# EAGLE design pcb v3 (EAGLE 7.5.0)
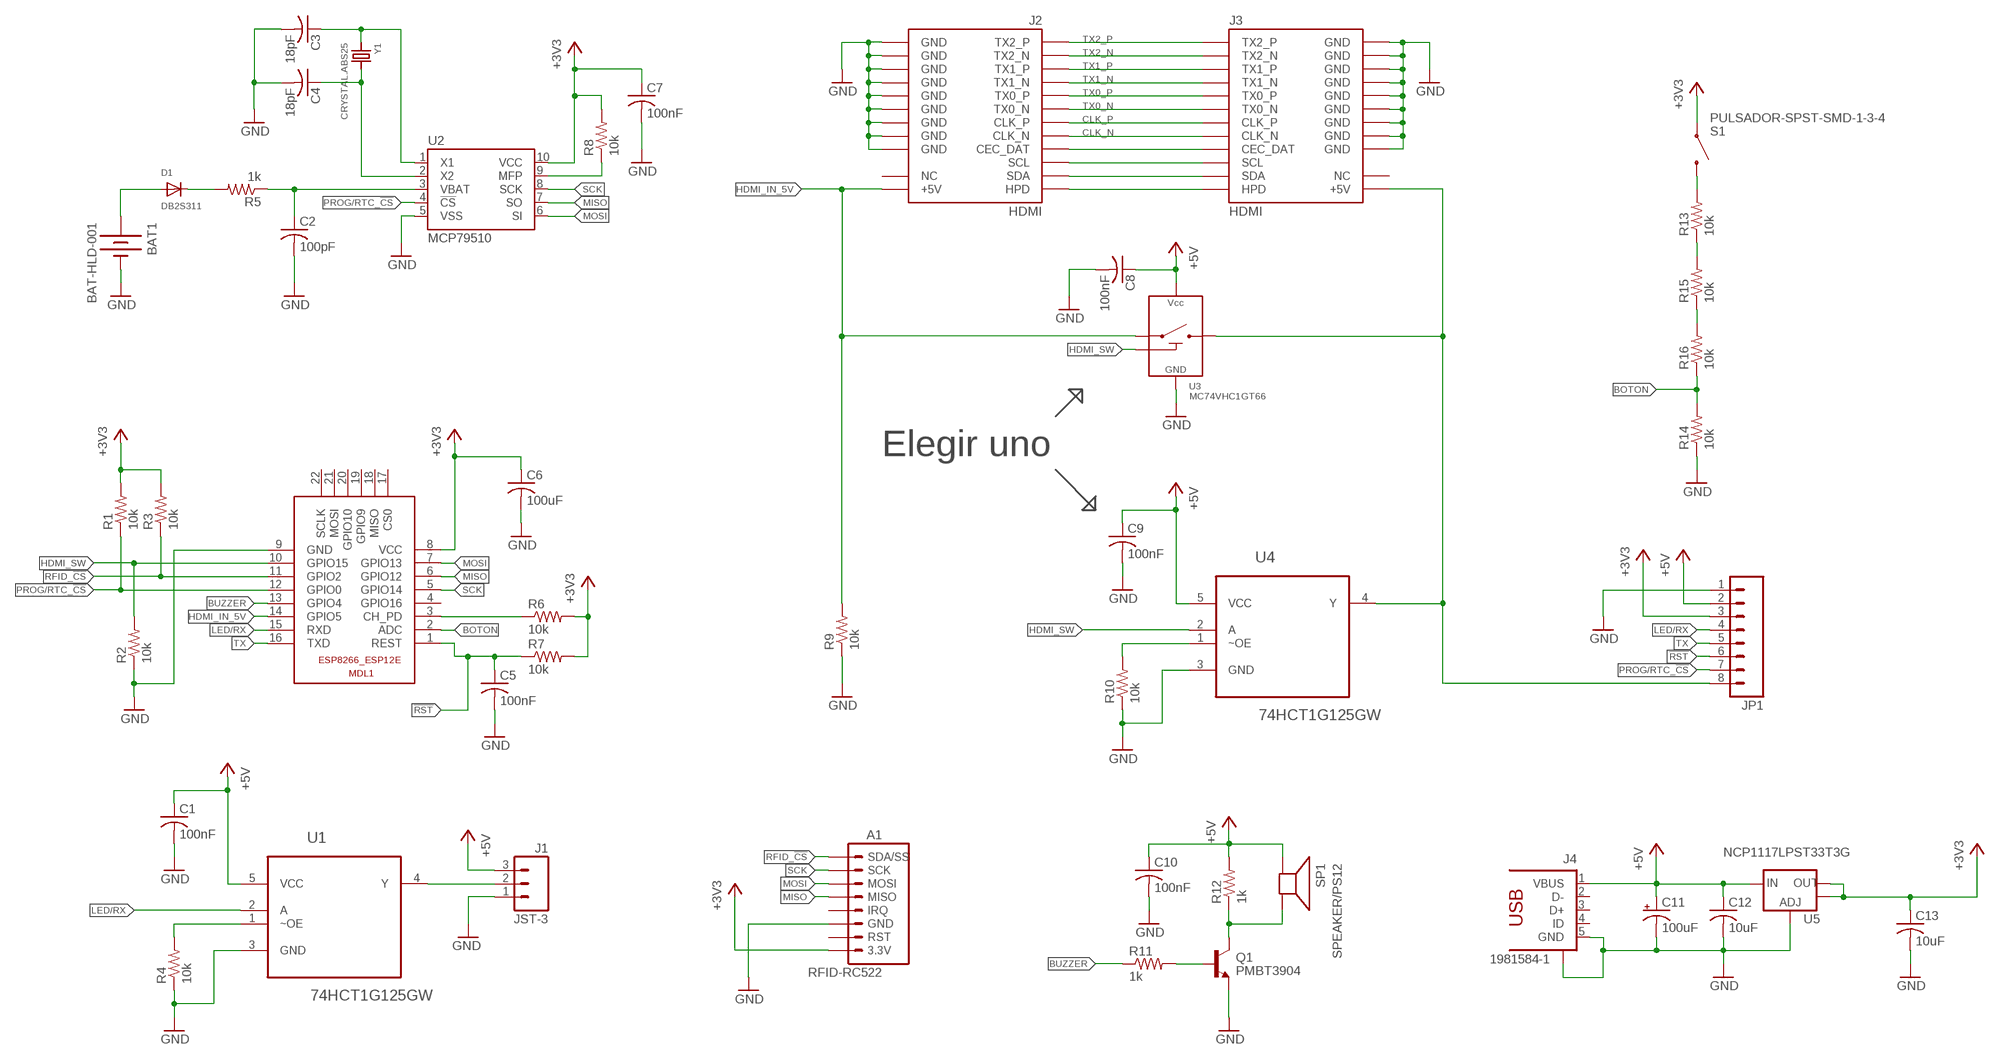
[diagram p0: schematic, sheet 1]

## Parts
A1  RFID-RC522  [RFID-RC522]
BAT1  BAT-HLD-001  LINX-BAT-HLD-00120SMD  [BATTCON_20MM]
C1  100nF  C-USC0805  [C0805]
C2  100pF  C-USC0805  [C0805]
C3  18pF  C-USC0805  [C0805]
C4  18pF  C-USC0805  [C0805]
C5  100nF  C-USC0805  [C0805]
C6  100uF  C-USC1206  [C1206]
C7  100nF  C-USC0805  [C0805]
C8  100nF  C-USC0805  [C0805]
C9  100nF  C-USC0805  [C0805]
C10  100nF  C-USC0805  [C0805]
C11  100uF  CPOL-US  [UD-6,3X5,8_NICHICON_LPADS]
C12  10uF  C-USC0805  [C0805]
C13  10uF  C-USC0805  [C0805]
D1  DB2S311  DIODESOD-523  [SOD-523]
J1  JST-3  [B3B-PH-SM4-TB]
J2  HDMI  [0471511071]
J3  HDMI  [0471511071]
J4  1981584-1  [1981584-1]
JP1  M081X08  [1X08]
MDL1  ESP8266-12EESP8266-ESP12E  [ESP8266-ESP12E]
Q1  PMBT3904  [SOT-23-3]
R1  10k  R-US_R0805  [R0805]
R2  10k  R-US_R0805  [R0805]
R3  10k  R-US_R0805  [R0805]
R4  10k  R-US_R0805  [R0805]
R5  1k  R-US_R0805  [R0805]
R6  10k  R-US_R0805  [R0805]
R7  10k  R-US_R0805  [R0805]
R8  10k  R-US_R0805  [R0805]
R9  10k  R-US_R0805  [R0805]
R10  10k  R-US_R0805  [R0805]
R11  1k  R-US_R0805  [R0805]
R12  1k  R-US_R0805  [R0805]
R13  10k  R-US_R0805  [R0805]
R14  10k  R-US_R0805  [R0805]
R15  10k  R-US_R0805  [R0805]
R16  10k  R-US_R0805  [R0805]
S1  PULSADOR-SPST-SMD-1-3-4  [PTS645SM43SMTR92]
SP1  SPEAKER/PS12  [PS12]
U1  74HCT1G125GW  [SOT65P210X110-5N]
U2  MCP79510  [MSOP10]
U3  MC74VHC1GT66  [TSOP-5]
U4  74HCT1G125GW  [SOT65P210X110-5N]
U5  NCP1117LPST33T3G  V_REG_LM1117SOT223  [SOT223]
Y1  CRYSTAL.ABS25  [ABS25]

## Nets
!RST: C5.1 JP1.6 MDL1.1(REST) R7.1
+3V3: A1.3.3V C6.1 C7.1 C13.1 JP1.3 MDL1.8(VCC) R1.2 R3.2 R6.2 R7.2 R8.2 S1.P$1 U2.10(VCC) U5.2(OUT) U5.4(OUT)
+5V: C1.1 C8.1 C9.1 C10.1 C11.+ C12.1 J1.3 J4.1(VBUS) JP1.2 R12.2 SP1.P$1(+) U1.5(VCC) U3.5 U4.5(VCC) U5.3(IN)
BOTON: MDL1.2(ADC) R14.2 R16.1
BUZZER: MDL1.13(GPIO4) R11.1
CLK_N [hdmi]: J2.P$12(CLK_N) J3.P$12(CLK_N)
CLK_P [hdmi]: J2.P$10(CLK_P) J3.P$10(CLK_P)
GND [gnd]: A1.GND BAT1.2(-) C1.2 C2.2 C3.2 C4.2 C5.2 C6.2 C7.2 C8.2 C9.2 C10.2 C11.- C12.2 C13.2 J1.1 J2.P$2(GND) J2.P$5(GND) J2.P$8(GND) J2.P$11(GND) J2.P$17(GND) J2.P$20(GND) J2.P$21(GND) J2.P$22(GND) J2.P$23(GND) J3.P$2(GND) J3.P$5(GND) J3.P$8(GND) J3.P$11(GND) J3.P$17(GND) J3.P$20(GND) J3.P$21(GND) J3.P$22(GND) J3.P$23(GND) J4.5(GND) J4.S1 J4.S2 J4.S3 J4.S4 JP1.1 MDL1.9(GND) Q1.2(E) R2.1 R4.1 R9.1 R10.1 R14.1 U1.3(GND) U2.5(VSS) U3.3 U4.3(GND) U5.1(ADJ)
HDMI_IN_5V: J2.P$18(+5V) MDL1.14(GPIO5) R9.2 U3.1
HDMI_OUT_5V: J3.P$18(+5V) JP1.8 U3.2 U4.4(Y)
HDMI_SW: MDL1.10(GPIO15) R2.2 U3.4 U4.2(A)
LED/RX: JP1.4 MDL1.15(RXD) U1.2(A)
MISO: A1.MISO MDL1.6(GPIO12) U2.7(SO)
MOSI: A1.MOSI MDL1.7(GPIO13) U2.6(SI)
N$1: Q1.1(B) R11.2
N$2: C3.1 U2.1(X1) Y1.1
N$3: C4.1 U2.2(X2) Y1.4
N$4: R4.2 U1.1(~OE)
N$5: Q1.3(C) R12.1 SP1.P$2(-)
N$6: R8.1 U2.9(MFP)
N$7: BAT1.1(+) D1.A
N$8: D1.K(C) R5.2
N$9: C2.1 R5.1 U2.3(VBAT)
N$10: MDL1.3(CH_PD) R6.1
N$11: J1.2 U1.4(Y)
N$12: R13.2 S1.P$3 S1.P$4
N$13: R13.1 R15.2
N$14: R15.1 R16.2
N$15: R10.2 U4.1(~OE)
N$30: J2.P$13(CEC_DAT) J3.P$13(CEC_DAT)
N$31: J2.P$15(SCL) J3.P$15(SCL)
N$32: J2.P$16(SDA) J3.P$16(SDA)
N$33: J2.P$19(HPD) J3.P$19(HPD)
PROG/RTC_!CS: JP1.7 MDL1.12(GPIO0) R1.1 U2.4(!CS)
RFID_!CS: A1.SDA(SDA/SS) MDL1.11(GPIO2) R3.1
SCK: A1.SCK MDL1.5(GPIO14) U2.8(SCK)
TX: JP1.5 MDL1.16(TXD)
TX0_N [hdmi]: J2.P$9(TX0_N) J3.P$9(TX0_N)
TX0_P [hdmi]: J2.P$7(TX0_P) J3.P$7(TX0_P)
TX1_N [hdmi]: J2.P$6(TX1_N) J3.P$6(TX1_N)
TX1_P [hdmi]: J2.P$4(TX1_P) J3.P$4(TX1_P)
TX2_N [hdmi]: J2.P$3(TX2_N) J3.P$3(TX2_N)
TX2_P [hdmi]: J2.P$1(TX2_P) J3.P$1(TX2_P)
Unconnected: A1.IRQ A1.RST J2.P$14(NC) J3.P$14(NC) J4.2(D-) J4.3(D+) J4.4(ID) MDL1.4(GPIO16) MDL1.17(CS0) MDL1.18(MISO) MDL1.19(GPIO9) MDL1.20(GPIO10) MDL1.21(MOSI) MDL1.22(SCLK)

## Notes on the sheet
- Elegir uno

## Library data of the parts
A1 = partes v2:RFID-RC522
BAT1 = battery:LINX-BAT-HLD-001: Battery Holders Linxtechnologies CR2032 battery holder: http://www.linxtechnologies.com/resources/diagrams/bat-hld-001.pdf
C1-C10 C12 C13 = rcl:C-US: CAPACITOR, American symbol
C11 = hoky:CPOL-US
D1 = adafruit:DIODE: Diode SMADIODE - SMA Surface Mount Package 20V 1A Schottky Diode Digikey: 641-1014-6-ND DO-1N4148 - Through Hole Small Current Diode SOD-123 20V 1 A (.5mV Vf) Schottky Diode - Digikey: MBRX120TPMSCT-ND SOD-323 10V 570mA (.38mV Vf, 3ns) Schottky Diode - Digikey: ZLLS410CT-ND SOD-523 30V 30mA Schottky Diode (RB751S-40TE61) - Digikey: RB751S-40TE61CT-ND SOT23-R/W - SOT23 Package (R = Solder Paste/Reflow Ovens, W = Hand-Soldering) BAT54Film 40V 300mA - Digikey: 497-7162-1-ND
J1 = partes v2:JST-3
J2 J3 = partes v2:HDMI
J4 = con-usb:1981584-1: Receptacle, micro-USB, type A/B Tyco Electronics
JP1 = SparkFun-Connectors:M08: Header 8 Standard 8-pin 0.1" header. Use with straight break away headers (SKU : PRT-00116), right angle break away headers (PRT-00553), swiss pins (PRT-00743), machine pins (PRT-00117), and female headers (PRT-00115).
MDL1 = ESP8266-ESP12E:ESP8266-12E: ESP8266-12E with additional I/O and GPIO04/05 corrected The author cannot warrant that this library is free from error or will meet your specific requirements. Created by PuceBaboon.com. Komagane, Nagano, JAPAN
Q1 = diego:PMBT3904: PMBT3904 NPN switching transistor in a SOT23 plastic package. PNP complement: PMBT3906.
R1-R16 = rcl:R-US_: RESISTOR, American symbol
S1 = partes v2:PULSADOR-SPST
SP1 = adafruit:SPEAKER: SPEAKER Source: Buerklin Added PS12 (for part # PS1240 piezo) http://www.ladyada.net/library/pcb/eaglelibrary.html
U1 U4 = NXP_By_element14_Batch_1:74HCT1G125GW: Bus buffer/line driver; MPN: 74HCT1G125GW; OC_FARNELL: 1085267; OC_NEWARK: 99K0542; PACKAGE: SOT-5; SUPPLIER: NXP
U2 = hoky:MCP79510
U3 = hoky:MC74VHC1GT66
U5 = SparkFun-PowerIC:V_REG_LM1117: Voltage Regulator LM1117 Standard adjustable voltage regulator but in SMD form. Spark Fun Electronics SKU : COM-00595
Y1 = abracon:CRYSTAL

## Net classes
0 default: width 0.254 mm
1 hdmi: width 0.3 mm, clearance 0.178 mm
2 gnd: width 0.254 mm

## Board
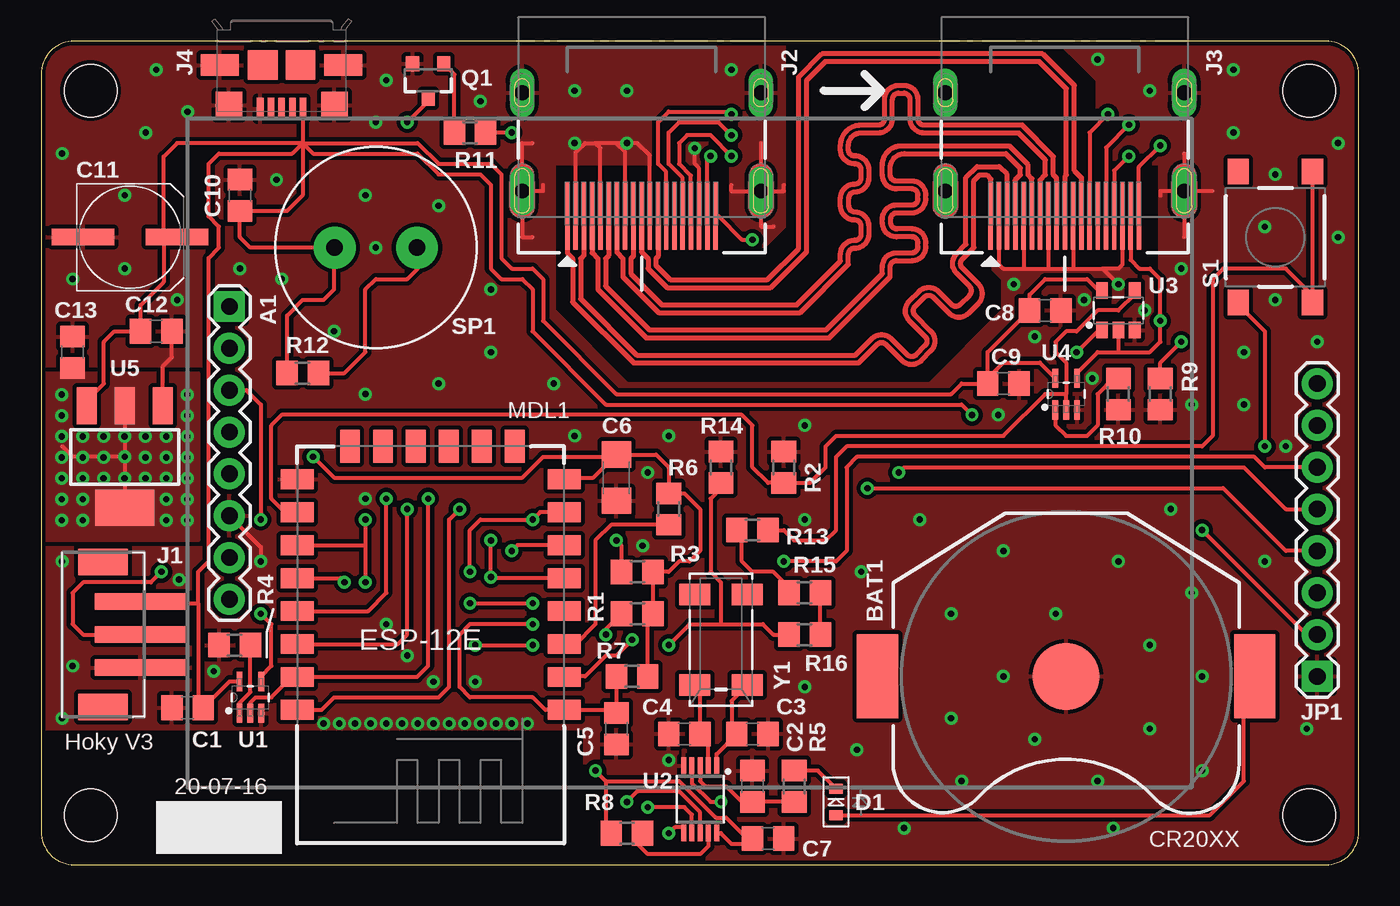
[diagram p1: board, top side]
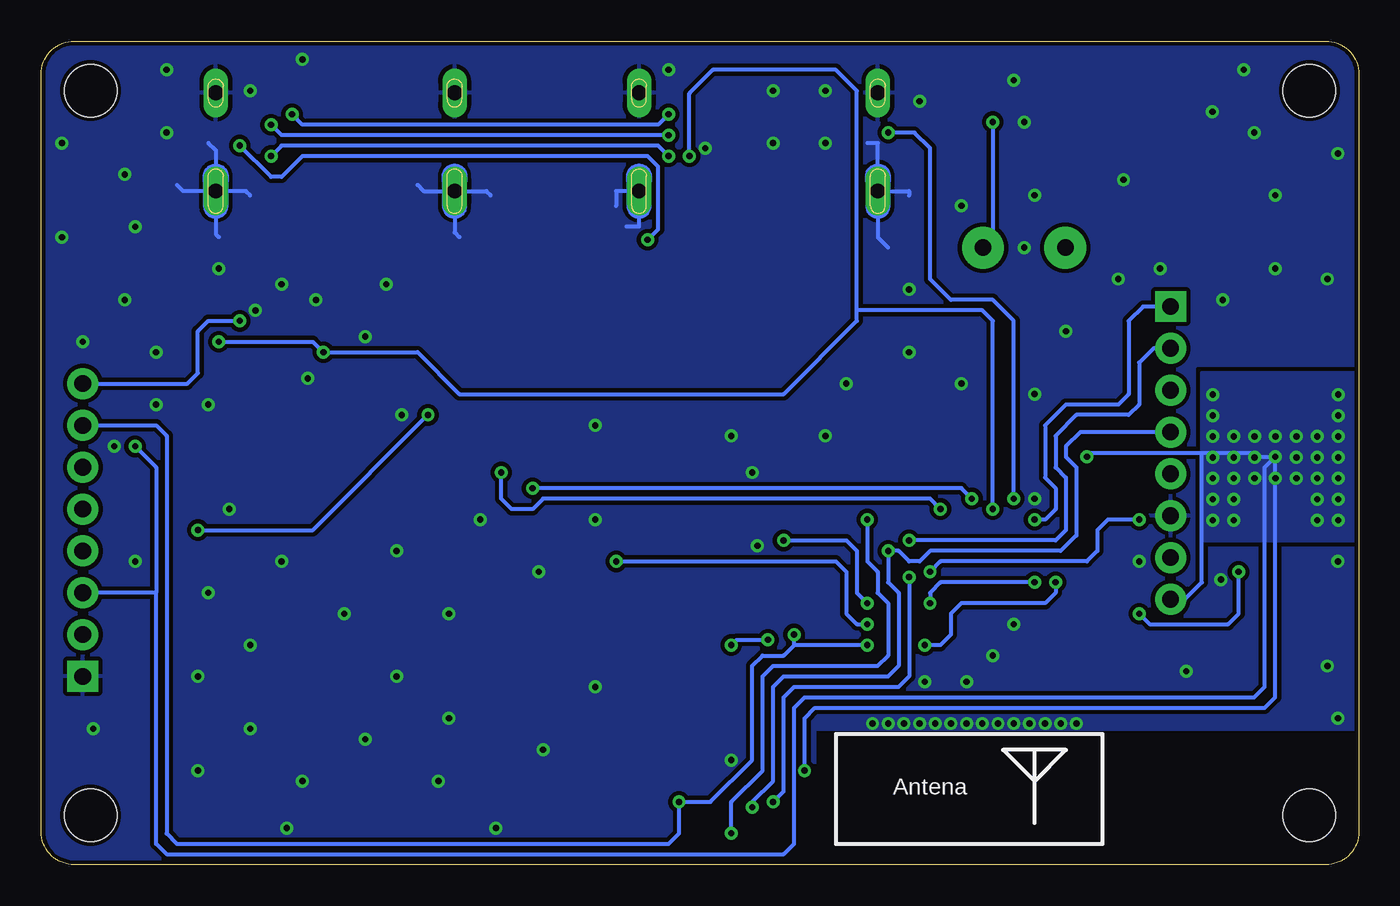
[diagram p2: board, bottom side, seen from below]

Size 80 x 50 mm. Coordinates in mm from the lower left corner, seen from the top.
Outline: 0,2 arc90 2,0 78,0 arc90 80,2 80,48 arc90 78,50 2,50 arc90 0,48 0,2
Copper layers (1*16): Top 0.035mm / dielectric 1.5mm / Bottom 0.035mm
Design rules "ITead_rule": minimum track width 6mil, minimum drill 12mil, track to track 6mil, track to pad 6mil, pad to pad 6mil, via to via 6mil, smd to smd 0mil, copper to edge 10mil, drill to drill 10mil, minimum pad ring 10mil, minimum via ring 6mil, stop-mask expansion 2mil, vias tented up to drill 100mil, thermal gap 10mil
Holes 3.17 mm at 3,47 77,47 3,3 77,3

### Footprints (pad centres in the part's own frame; a part is rotated, then mirrored left to right if it is on the bottom)
RFID-RC522 = drill 1.016 pad 1.88: 3.3V 8.89,0; GND 3.81,0; IRQ 1.27,0; MISO -1.27,0; MOSI -3.81,0; RST 6.35,0; SCK -6.35,0 | drill 1.016 pad 1.88 square: SDA -8.89,0
BATTCON_20MM = smd 2.5 x 5.1: 1 -11.45,0; 3 11.45,0 | smd 4.064 x 4.064: 2 0,0
C0805 = smd 1.3 x 1.5: 1 -0.95,0; 2 0.95,0
C1206 = smd 1.6 x 1.8: 1 -1.4,0; 2 1.4,0
UD-6,3X5,8_NICHICON_LPADS = smd 3.8 x 1: + 2.85,0; - -2.85,0
SOD-523 = smd 0.8 x 0.6: A 0,-0.8; K 0,0.8
B3B-PH-SM4-TB = smd 1 x 5.5: 1 -2,-0.3; 2 0,-0.3; 3 2,-0.3 | smd 1.6 x 3: NC1 -4.4,1.95; NC2 4.4,1.95
0471511071 = smd 0.3 x 4.1: P$1 4.5,3.75; P$2 4,3.75; P$3 3.5,3.75; P$4 3,3.75; P$5 2.5,3.75; P$6 2,3.75; P$7 1.5,3.75; P$8 1,3.75; P$9 0.5,3.75; P$10 0,3.75; P$11 -0.5,3.75; P$12 -1,3.75; P$13 -1.5,3.75; P$14 -2,3.75; P$15 -2.5,3.75; P$16 -3,3.75; P$17 -3.5,3.75; P$18 -4,3.75; P$19 -4.5,3.75 | drill 0.9 pad 1.5 long: P$20 -7.25,2.24; P$21 7.25,2.24; P$22 -7.25,-3.72; P$23 7.25,-3.72
1981584-1 = smd 0.4 x 1.35: 1 -1.3,4.1; 2 -0.65,4.1; 3 0,4.1; 4 0.65,4.1; 5 1.3,4.1 | smd 1.8 x 1.8: M1 -1.15,1.45; M2 1.15,1.45 | smd 2.3 x 1.3: S1 -3.75,1.45; S2 3.75,1.45 | smd 1.6 x 1.6: S3 -3.2,3.885; S4 3.2,3.885
1X08 = drill 1.016 pad 1.88 square: 1 0,0 | drill 1.016 pad 1.88: 2 2.54,0; 3 5.08,0; 4 7.62,0; 5 10.16,0; 6 12.7,0; 7 15.24,0; 8 17.78,0
ESP8266-ESP12E = smd 2 x 1.2: 1 0,16; 2 0,14; 3 0,12; 4 0,10; 5 0,8; 6 0,6; 7 0,4; 8 0,2; 9 16.2,2; 10 16.2,4; 11 16.2,6; 12 16.2,8; 13 16.2,10; 14 16.2,12; 15 16.2,14; 16 16.2,16 | smd 1.2 x 2: 17 11,0; 18 3,0; 19 5,0; 20 13,0; 21 7,0; 22 9,0
SOT-23-3 = smd 0.8 x 0.9: 1 -0.95,-1; 2 0.95,-1; 3 0,1.1
R0805 = smd 1.3 x 1.5: 1 -0.95,0; 2 0.95,0
PTS645SM43SMTR92 = smd 1.55 x 1.3: P$1 -3.975,2.25; P$2 3.975,2.25; P$3 -3.975,-2.25; P$4 3.975,-2.25
PS12 = drill 1 pad 2.54: P$1 -2.5,0; P$2 2.5,0
SOT65P210X110-5N = smd 1.168 x 0.356: 1 -0.965,0.66; 2 -0.965,0; 3 -0.965,-0.66; 4 0.965,-0.66; 5 0.965,0.66
MSOP10 = smd 0.3 x 1: 1 -1,-2.05; 2 -0.5,-2.05; 3 0,-2.05; 4 0.5,-2.05; 5 1,-2.05; 6 1,2.05; 7 0.5,2.05; 8 0,2.05; 9 -0.5,2.05; 10 -1,2.05
TSOP-5 = smd 0.7 x 1: 1 -0.99,-1.2; 2 0,-1.2; 3 0.99,-1.2; 4 0.99,1.2; 5 -0.99,1.2
SOT223 = smd 1.219 x 2.235: 1 -2.311,-3.099; 2 0,-3.099; 3 2.311,-3.099 | smd 3.6 x 2.2: 4 0,3.099
ABS25 = smd 1.3 x 1.9: 1 -2.75,-1.6; 2 2.75,-1.6; 3 2.75,1.6; 4 -2.75,1.6

### Placement (x,y rotation side)
A1  11.43,25 270 top
BAT1  62.23,11.43 180 top
C1  8.89,9.53 180 top
C2  43.18,4.76 90 top
C3  43.18,7.94 0 top
C4  39.05,7.94 180 top
C5  34.92,8.26 270 top
C6  34.92,23.5 270 top
C7  44.13,1.59 0 top
C8  60.96,33.66 0 top
C9  58.42,29.21 0 top
C10  12.06,40.64 90 top
C11  5.4,38.1 0 top
C12  6.99,32.38 0 top
C13  1.91,31.11 90 top
D1  48.26,3.81 0 top
J1  5.71,13.97 90 top
J2  36.45,43.14 180 top
J3  62.15,43.14 180 top
J4  14.6,50 180 top
JP1  77.47,11.43 90 top
MDL1  31.75,25.4 180 top
Q1  23.5,47.62 180 top
R1  36.2,15.24 0 top
R2  45.09,24.13 270 top
R3  36.2,17.78 0 top
R4  11.75,13.34 0 top
R5  45.72,4.76 90 top
R6  38.1,21.59 90 top
R7  35.88,11.43 0 top
R8  35.56,1.91 180 top
R9  67.94,28.57 90 top
R10  65.41,28.57 90 top
R11  26.04,44.45 180 top
R12  15.88,29.84 180 top
R13  43.18,20.32 0 top
R14  41.27,24.13 270 top
R15  46.35,16.51 180 top
R16  46.35,13.97 0 top
S1  74.93,38.1 90 top
SP1  20.32,37.47 0 top
U1  12.7,10.16 90 top
U2  40.01,3.96 180 top
U3  65.41,33.66 0 top
U4  62.23,28.57 90 top
U5  5.08,24.77 180 top
Y1  41.27,13.65 90 top

### Tracks (layer width: path | path; a pad name or v marks a point on that pad's centre or on a via)
!RST  (via drill 0.38 pad 0.79)
  Top 0.254: JP1.6 74.3,24.13 73.66,24.77 49.53,24.77 48.9,24.13 48.9,19.05 48.26,18.41 v45.09,18.41 | R7.1 C5.1 34.73,9.4 MDL1.1 30.61,9.4 29.84,10.16 26.04,10.16 25.4,10.79 25.4,13.97 26.04,14.61 v29.84,14.61
  Bottom 0.254: v45.09,18.41 31.75,18.41 31.11,17.78 31.11,15.24 30.48,14.61 v29.84,14.61
+3V3  (via drill 0.38 pad 0.79)
  Top 0.254: U5.2 v5.08,24.77 | v5.08,24.77 1.91,24.77 1.27,25.4 | v5.08,24.77 U5.4 | MDL1.8 31.66,23.5 33.52,23.5 C6.1 | v16.51,24.77 17.78,23.5 29.21,23.5 30.48,24.77 34.8,24.77 C6.1 | 34.29,5.08 v33.66,5.71 | 34.29,5.08 34.29,2.23 R8.2 | 34.29,5.08 38.73,5.08 40.96,2.86 41.59,2.86 42.55,1.91 42.87,1.91 C7.1 42.87,1.27 41.91,1.27 41.27,1.92 U2.10 | C6.1 37.34,24.89 38.1,24.13 R6.2 39.05,22.54 40.01,21.59 40.01,19.05 39.37,18.41 38.73,18.41 38.1,17.78 R3.2 R1.2 36.83,14.92 R7.2 | S1.P$1 72.68,34 74.3,32.38 v74.3,25.4
  Bottom 0.254: 9.53,25 16.27,25 v16.51,24.77 | 9.53,25 6.35,25 6.12,24.77 v5.08,24.77 | v33.66,5.71 33.66,8.89 33.02,9.53 5.71,9.53 5.08,10.16 v5.08,24.77 | v5.08,24.77 5.71,24.13 5.71,10.79 6.35,10.16 33.66,10.16 34.29,9.53 34.29,1.27 34.92,0.64 72.39,0.64 73.03,1.27 73.03,16.51 | A1.3.3V 10.56,16.11 9.53,17.14 9.53,25 | 73.03,16.51 JP1.3 | v74.3,25.4 73.03,24.13 73.03,16.51
  other vias: 8.87,24.73 1.25,24.73 2.52,24.73 3.79,24.73 6.33,24.73 7.6,24.73 1.25,26 2.52,26 3.79,26 5.06,26 6.33,26 7.6,26 8.87,26 8.87,23.46 7.6,23.46 6.33,23.46 5.06,23.46 3.79,23.46 2.52,23.46 1.25,23.46 1.25,27.27 1.25,28.54 8.87,27.27 8.87,28.54 1.25,22.19 1.25,20.92 2.52,20.92 2.52,22.19 7.6,22.19 7.6,20.92 8.87,20.92 8.87,22.19
  pour Top (isolate 0.254, no thermals): -0.64,29.84 9.53,29.84 9.53,19.68 -1.27,19.68
  pour Bottom (isolate 0.254, no thermals): -0.64,29.84 9.53,29.84 9.53,19.68 -1.91,19.68
+5V  (via drill 0.38 pad 0.79)
  Top 0.254: 15.88,43.81 8.26,43.81 7.43,42.99 7.43,38.29 7.62,38.1 | 7.62,38.1 7.43,37.91 7.43,35.37 6.04,33.98 C12.1 4.45,32.38 3.81,31.75 3.81,29.21 2.77,28.17 U5.3 | C11.+ 7.62,38.1 | J4.1 15.9,45.74 15.88,45.72 15.88,43.81 | R12.2 14.93,33.34 15.88,34.29 17.14,34.29 17.78,34.92 17.78,37.42 SP1.P$1 12.7,37.47 12.06,38.1 C10.1 14.93,39.69 15.88,40.64 15.88,43.81 | 9.53,15.88 9.53,17.78 10.16,18.41 10.16,36.83 10.79,37.47 10.79,38.73 10.16,39.37 10.16,42.55 10.79,43.18 15.24,43.18 15.88,43.81 | 9.53,15.88 9.53,9.84 C1.1 11.44,11.12 U1.5 | J1.3 6.11,15.88 9.53,15.88 | 15.88,43.81 22.86,43.81 24.13,42.55 27.3,42.55 27.94,41.91 27.94,36.83 28.57,36.2 29.84,36.2 30.48,35.56 30.48,33.02 34.92,28.57 55.24,28.57 55.88,29.21 C9.1 | v56.52,27.3 55.88,27.94 34.29,27.94 29.84,32.38 29.84,34.92 29.21,35.56 27.94,35.56 27.3,36.2 27.3,41.27 26.67,41.91 24.13,41.91 22.86,43.18 16.51,43.18 15.88,43.81 | C9.1 57.47,31.11 C8.1 60.01,34.61 60.96,35.56 63.5,35.56 64.2,34.85 U3.5 | C9.1 57.47,29.53 58.42,30.48 60.63,30.48 U4.5 | JP1.2 76.83,13.97 v70.48,20.32
  Bottom 0.254: v70.48,20.32 63.5,20.32 v56.52,27.3
BOTON  (via drill 0.38 pad 0.79)
  Top 0.254: v35.88,13.65 34.92,12.7 34.29,12.7 33.02,11.43 31.78,11.43 MDL1.2 | v38.1,13.34 39.37,14.61 41.27,14.61 | 41.27,14.61 43.81,14.61 44.45,13.97 R16.1 | R14.2 41.27,22.86 40.64,22.23 40.64,17.78 41.27,17.14 41.27,14.61
  Bottom 0.254: v38.1,13.34 37.78,13.65 v35.88,13.65
BUZZER  (via drill 0.38 pad 0.79)
  Top 0.254: MDL1.13 19.84,15.4 20.95,16.51 v20.95,22.23 | v28.57,44.45 R11.1
  Bottom 0.254: v20.95,22.23 20.95,33.02 22.23,34.29 24.77,34.29 26.04,35.56 26.04,43.5 R11.1 v28.57,44.45
CLK_N
  Top 0.3: J3.P$12 63.15,41.71 62.72,42.14 62.72,47.31 60.8,49.23 47.4,49.23 45.99,47.82 45.99,37.41 44.1,35.52 38.2,35.52 37.32,36.39 37.32,36.8 37.45,36.93 J2.P$12
CLK_P
  Top 0.3: J3.P$10 62.15,41.79 62.24,41.88 62.24,47.12 60.61,48.76 47.6,48.76 46.47,47.62 46.47,37.21 44.3,35.04 38,35.04 36.84,36.2 36.84,36.8 36.45,37.2 J2.P$10
GND  (via drill 0.38 pad 0.79)
  Top 0.254: U5.1 7.39,30.25 7.93,30.8 C12.2 | A1.GND 13.34,19.29 v13.34,18.41 | 30.48,41.27 30.48,40.9 J2.P$21 | J2.P$21 29.2,38.1 29.84,38.1 | J2.P$21 29.2,43.81 29.84,43.81 | 41.91,41.27 41.91,40.9 45.09,40.9 45.09,41.27 | 43.7,43.81 43.7,38.73 44.45,38.73 | 69.85,43.18 69.4,43.18 69.4,38.1 | 71.12,40.9 67.94,40.9 67.94,40.64 | J2.P$2 32.45,43.24 33.02,43.81 33.66,43.81 | J2.P$5 33.95,43.52 33.66,43.81 | J2.P$8 35.45,43.29 34.92,43.81 | 34.92,43.81 33.66,43.81 | J2.P$11 36.95,43.06 36.2,43.81 34.92,43.81 | J2.P$17 39.95,42.28 39.69,42.55 v39.69,43.5 | 61.15,36.2 62.65,36.2 | 62.65,36.2 64.45,36.2 | 64.45,36.2 v65.41,35.24 | J3.P$8 61.15,36.2 | J3.P$2 58.15,36.47 58.42,36.2 59.65,36.2 | 59.65,36.2 61.15,36.2 | J3.P$5 59.65,36.2 | J3.P$11 62.65,36.2 | J3.P$17 65.65,36.44 65.41,36.2 64.45,36.2
  Bottom 0.254: 28.57,37.47 29.2,38.09 J2.P$21 | 57.15,41.27 56.77,40.9 52.97,40.9 52.7,40.64 | J3.P$21 54.9,38.39 54.61,38.1 | 67.31,40.64 67.57,40.9 J3.P$20 71.38,40.9 71.75,41.27 | 69.85,43.81 69.4,43.37 69.4,38.28 69.22,38.1 | 27.3,40.64 27.3,40.9 J2.P$21 | J2.P$21 29.2,43.81 29.84,43.81 | 44.45,38.73 43.7,38.73 J2.P$20 45.09,40.9 45.09,40.01
  other vias: 1.91,35.56 8.26,34.29 19.68,40.64 27.3,31.11 22.23,12.7 20.95,14.61 23.81,11.11 1.91,12.06 8.37,17.32 19.68,22.23 10.48,11.75 26.35,11.11 22.86,8.57 46.35,10.79 38.1,26.04 46.35,26.67 36.83,23.81 36.51,19.37 58.1,27.3 74.3,38.73 73.03,27.94 73.03,31.11 69.85,27.94 49.78,17.78 60.33,32.07 66.99,33.66 63.32,34.29 59.05,35.24 63.82,29.53 5.08,36.2 5.08,40.64 1.27,43.18 6.35,44.45 6.99,48.26 8.89,45.72 20.95,47.62 20.32,45.09 26.67,46.35 32.38,46.99 35.56,43.81 32.38,43.81 35.56,46.99 41.91,48.26 24.13,40.01 12.06,36.2 14.61,35.56 17.78,32.38 27.3,34.92 31.11,29.21 24.13,29.21 32.38,26.04 46.35,20.95 1.27,18.41 1.27,8.89 19.68,28.57 20.32,37.47 64.14,48.9 67.31,46.99 72.39,48.26 72.39,44.45 74.93,41.91 69.22,36.2 74.93,34.29 78.74,38.1 78.74,43.81 77.47,31.75 75.56,25.4 74.3,18.41 68.58,21.59 53.34,20.95 76.83,8.26 52.39,2.22 49.53,6.99 38.1,6.35 21.91,8.57 20.95,8.57 20,8.57 19.05,8.57 18.1,8.57 23.81,8.57 24.77,8.57 25.72,8.57 26.67,8.57 27.62,8.57 17.14,8.57 28.57,8.57 29.53,8.57 58.42,19.05 55.24,15.24 65.41,18.41 69.85,16.51 61.59,15.24 67.31,13.34 58.42,11.43 55.24,8.89 60.33,7.62 64.14,5.08 67.31,8.26 70.48,5.71 70.48,11.43 55.88,5.08 65.09,2.22 14.29,41.59
  pour Top (isolate 0.254, rank 2): 45.09,50.8 45.09,38.73 43.18,36.83 41.91,36.83 41.91,42.55 31.11,42.55 31.11,33.66 35.56,29.21 53.98,29.21 58.42,33.66 58.42,35.56 57.78,36.2 67.94,36.2 67.94,42.55 64.14,42.55 64.14,47.62 60.96,50.8 80.64,50.8 80.64,-0.64 33.02,-0.64 33.02,8.26 -0.64,8.26 -0.64,50.8
  pour Bottom (isolate 0.254, rank 2): -0.64,50.8 80.64,50.8 80.64,-0.64 33.02,-1.27 33.02,8.26 -0.64,8.26
HDMI_IN_5V  (via drill 0.38 pad 0.79)
  Top 0.254: J2.P$18 40.45,42.84 v40.64,43.02 | U3.1 64.2,32.45 v62.87,31.11 | R9.2 67.94,30.48 v69.22,31.75 | MDL1.14 21.66,13.4 22.23,13.97 v22.23,21.59
  Bottom 0.254: v40.64,43.02 40.64,46.84 39.22,48.26 31.75,48.26 30.48,46.99 30.48,33.66 | 30.48,33.66 30.48,33.02 34.92,28.57 54.61,28.57 57.15,31.11 v62.87,31.11 63.5,31.75 v69.22,31.75 | v22.23,21.59 22.23,33.02 22.86,33.66 30.48,33.66
HDMI_OUT_5V  (via drill 0.38 pad 0.79)
  Top 0.254: U3.2 65.41,31.11 | 65.41,31.11 67.31,31.11 67.94,31.75 v67.94,33.02 67.94,35.56 67.31,36.2 66.67,36.2 66.15,36.72 J3.P$18 | U4.4 62.89,29.87 64.14,31.11 65.41,31.11
  Bottom 0.254: JP1.8 71.12,29.21 70.48,29.84 70.48,32.38 69.85,33.02 v67.94,33.02
HDMI_SW
  Top 0.254: U3.4 66.39,34.65 65.41,33.66 64.14,33.66 62.87,32.38 62.23,32.38 61.59,31.75 61.59,31.11 62.23,30.48 62.23,28.57 | 62.23,28.57 60.96,28.57 58.42,26.04 48.26,26.04 47.62,25.4 47.62,24.13 46.67,23.18 R2.2 44.13,23.18 43.18,24.13 43.18,26.67 42.55,27.3 14.61,27.3 13.97,26.67 13.97,22.23 14.79,21.4 MDL1.10 | U4.2 62.23,28.57
LED/RX  (via drill 0.38 pad 0.79)
  Top 0.254: U1.2 12.7,9.84 13.02,10.16 13.97,10.16 15.21,11.4 MDL1.15 22.83,11.4 23.5,12.06 v23.5,22.23 | v50.16,22.86 71.75,22.86 75.56,19.05 JP1.4
  Bottom 0.254: v23.5,22.23 24.13,22.86 v50.16,22.86
MISO  (via drill 0.38 pad 0.79)
  Top 0.254: U2.7 39.51,3.04 39.05,3.49 v36.83,3.49 | MDL1.6 28.93,19.4 v28.57,19.05
  Bottom 0.254: v36.83,3.49 36.83,3.81 35.56,5.08 35.56,10.79 34.92,11.43 28.57,11.43 27.94,12.06 27.94,16.51 28.57,17.14 v28.57,19.05 27.94,19.05 27.3,18.41 26.67,18.41 26.04,19.05 18.1,19.05 17.14,20 17.14,24.13 17.78,24.77 17.78,25.4 16.91,26.27 A1.MISO
MOSI  (via drill 0.38 pad 0.79)
  Top 0.254: U2.6 39.01,2.27 38.47,2.27 v38.1,1.91 | MDL1.7 30.29,21.4 v29.84,20.95 26.67,20.95 26.04,20.32 v26.04,17.78 | A1.MOSI 12.46,28.81 13.34,27.94 v13.34,20.95
  Bottom 0.254: v38.1,1.91 38.1,3.81 36.2,5.71 36.2,11.43 35.56,12.06 29.21,12.06 28.57,12.7 28.57,15.88 29.21,16.51 29.21,17.78 29.84,18.41 v29.84,20.95 | v26.04,17.78 25.4,18.41 16.51,18.41 15.88,19.05 15.88,20.32 15.24,20.95 v13.34,20.95
N$1
  Top 0.254: R11.2 25.09,47.98 Q1.1
N$2
  Top 0.254: U2.1 41.01,6.71 C3.1 41.91,8.26 41.91,9.94 Y1.1
N$3
  Top 0.254: U2.2 40.51,7.43 C4.1 40,10.57 Y1.4
N$4
  Top 0.254: U1.1 12.04,9.82 12.7,10.48 R4.2
N$5  (via drill 0.38 pad 0.79)
  Top 0.254: R12.1 18.41,29.84 19.68,31.11 19.68,34.92 20.32,35.56 22.23,35.56 22.86,36.2 22.86,37.42 SP1.P$2 | Q1.3 23.5,46.35 v22.23,45.09
  Bottom 0.254: v22.23,45.09 22.23,38.06 SP1.P$2
N$6
  Top 0.254: U2.9 40.51,1.14 40.01,0.64 36.83,0.64 36.2,1.27 36.2,1.59 R8.1
N$7
  Top 0.254: D1.A 70.95,3.01 73.03,5.08 73.03,10.78 BAT1.1
N$8
  Top 0.254: D1.K 47.16,5.71 R5.2
N$9
  Top 0.254: R5.1 C2.1 42.55,3.81 41.59,4.76 40.32,4.76 40.01,5.08 U2.3
N$10
  Top 0.254: R6.1 34.61,20.64 33.66,19.68 33.66,14.61 32.38,13.34 31.82,13.34 MDL1.3
N$11  (via drill 0.38 pad 0.79)
  Top 0.254: U1.4 13.36,11.46 13.97,12.06 13.97,14.61 v13.34,15.24 | v7.3,17.78 6.67,17.14 2.54,17.14 1.91,16.51 1.91,14.61 2.54,13.97 J1.2
  Bottom 0.254: v13.34,15.24 12.7,14.61 7.94,14.61 7.3,15.24 v7.3,17.78
N$12
  Top 0.254: S1.P$4 S1.P$3 77.18,34.58 75.56,36.2 71.75,36.2 71.12,35.56 71.12,26.04 70.48,25.4 48.9,25.4 48.26,24.77 48.26,20.32 47.62,19.68 45.72,19.68 45.09,20.32 R13.2
N$13
  Top 0.254: R15.2 45.41,16.82 44.45,17.78 43.18,17.78 42.55,18.41 42.55,20 R13.1
N$14
  Top 0.254: R16.2 R15.1
N$15
  Top 0.254: R10.2 65.08,29.52 64.14,28.57 64.14,26.67 63.82,26.35 63.5,26.04 62.23,26.04 61.57,26.7 U4.1
N$30  (via drill 0.38 pad 0.79)
  Top 0.254: J2.P$13 37.95,42.06 37.47,42.55 37.47,45.09 38.1,45.72 41.76,45.72 v41.91,45.56 | v64.77,45.56 63.65,44.45 J3.P$13
  Bottom 0.254: v41.91,45.56 42.55,44.93 64.14,44.93 v64.77,45.56
N$31  (via drill 0.38 pad 0.79)
  Top 0.254: J2.P$15 38.95,41.7 38.1,42.55 38.1,44.45 38.73,45.09 41.12,45.09 v41.91,44.3 | v66.04,44.93 64.65,43.54 J3.P$15
  Bottom 0.254: v41.91,44.3 65.41,44.3 v66.04,44.93
N$32  (via drill 0.38 pad 0.79)
  Top 0.254: v66.04,43.02 65.15,42.13 J3.P$16 | J2.P$16 39.45,41.83 38.73,42.55 38.73,43.81 39.22,44.3 40.64,44.3 v41.91,43.02
  Bottom 0.254: v41.91,43.02 42.55,43.66 65.41,43.66 v66.04,43.02
N$33  (via drill 0.38 pad 0.79)
  Top 0.254: J2.P$19 41.1,39.39 42.55,37.95 v43.18,37.95 | J3.P$19 66.65,42.37 v67.94,43.66
  Bottom 0.254: v43.18,37.95 42.55,38.58 42.55,42.39 43.18,43.02 64.14,43.02 65.41,41.76 66.04,41.76 v67.94,43.66
PROG/RTC_!CS  (via drill 0.38 pad 0.79)
  Top 0.254: U2.4 39.51,4.95 40.64,3.81 v41.27,3.81 | v34.29,13.97 34.29,14.29 R1.1 | MDL1.12 18.16,17.4 v18.41,17.14 | v26.35,13.34 v29.84,13.34
  Bottom 0.254: v29.84,13.34 34.29,13.34 | 34.29,13.34 v34.29,13.97 | 34.29,13.34 34.92,12.7 36.2,12.7 36.83,12.06 36.83,6.35 39.37,3.81 v41.27,3.81 41.27,1.91 41.91,1.27 71.75,1.27 72.39,1.91 72.39,26.04 73.03,26.67 JP1.7 | v18.41,17.14 18.41,16.51 19.05,15.88 24.13,15.88 24.77,15.24 24.77,13.97 25.4,13.34 v26.35,13.34
RFID_!CS  (via drill 0.38 pad 0.79)
  Top 0.254: R3.1 35.24,19.36 v34.92,19.68 | MDL1.11 19.68,19.4 | v19.68,20.95 19.68,19.4 | 19.68,19.4 v19.68,17.14 | v26.04,15.88 v29.84,15.88
  Bottom 0.254: v34.92,19.68 31.11,19.68 30.48,19.05 30.48,16.51 v29.84,15.88 | A1.SDA 13.1,33.89 13.97,33.02 13.97,28.57 14.61,27.94 17.78,27.94 19.05,26.67 19.05,23.5 18.41,22.86 18.41,21.59 19.05,20.95 v19.68,20.95 | v19.68,17.14 25.4,17.14 26.04,16.51 v26.04,15.88
SCK  (via drill 0.38 pad 0.79)
  Top 0.254: U2.8 40.01,3.17 38.73,4.45 36.2,4.45 v35.56,3.81 | v27.3,19.68 v27.3,17.46 27.37,17.4 MDL1.5
  Bottom 0.254: v35.56,3.81 34.92,4.45 34.92,10.16 34.29,10.79 27.94,10.79 27.3,11.43 v27.3,17.46 | A1.SCK 12.46,31.35 13.34,30.48 13.34,27.94 13.97,27.3 17.14,27.3 18.41,26.04 18.41,24.13 17.78,23.5 17.78,20.32 18.41,19.68 v27.3,19.68
TX  (via drill 0.38 pad 0.79)
  Top 0.254: v25.4,21.59 24.77,20.95 24.77,10.79 24.13,10.16 17.78,10.16 17.02,9.4 MDL1.16 | v52.07,23.81 52.39,24.13 73.03,24.13 75.56,21.59 JP1.5
  Bottom 0.254: v25.4,21.59 26.04,22.23 49.53,22.23 50.16,21.59 51.44,21.59 52.07,22.23 v52.07,23.81
TX0_N
  Top 0.3: J2.P$9 35.95,36.95 35.8,36.8 35.8,35.88 37.69,33.99 45.88,33.99 48.53,36.65 48.53,37.06 arc-90 49.38,37.91 49.41,37.91 arc90 49.78,38.29 49.78,38.77 arc90 49.41,39.14 49.38,39.14 arc-90 48.53,39.99 48.53,40.48 arc-90 49.38,41.33 49.41,41.33 arc90 49.78,41.7 49.78,42.18 arc90 49.41,42.56 49.38,42.56 arc-90 48.53,43.41 48.53,43.66 arc-90 49.78,44.91 50.84,44.91 arc90 51.21,45.29 51.21,46.47 arc-90 52.06,47.32 52.37,47.32 arc-90 53.22,46.47 53.22,45.29 arc90 53.59,44.91 59.53,44.91 61.45,43 61.45,41.88 61.65,41.69 J3.P$9
TX0_P
  Top 0.3: J2.P$7 34.95,37.17 35.32,36.8 35.32,35.69 37.49,33.52 46.07,33.52 49.01,36.45 49.01,37.06 arc-90 49.38,37.44 49.41,37.44 arc90 50.26,38.29 50.26,38.77 arc90 49.41,39.62 arc-90 49.04,39.99 49.04,40.48 arc-90 49.41,40.85 arc90 50.26,41.7 50.26,42.18 arc90 49.41,43.03 49.38,43.03 arc-90 49.01,43.41 49.01,43.66 arc-90 49.78,44.44 50.84,44.44 arc90 51.69,45.29 51.69,46.47 arc-90 52.06,46.84 52.37,46.84 arc-90 52.74,46.47 52.74,45.29 arc90 53.59,44.44 59.34,44.44 60.98,42.8 60.98,41.88 60.65,41.56 J3.P$7
TX1_N
  Top 0.3: J2.P$6 34.45,36.98 34.27,36.8 34.27,35.12 36.93,32.47 47.65,32.47 51.07,35.88 51.07,36.3 arc-90 51.92,37.15 52.86,37.15 arc90 53.23,37.52 53.23,37.75 arc90 52.86,38.12 51.92,38.12 arc-90 51.07,38.98 51.07,39.21 arc-90 51.92,40.06 52.86,40.06 arc90 53.23,40.43 53.23,40.66 arc90 52.86,41.03 51.92,41.03 arc-90 51.07,41.88 51.07,42.49 arc-90 52.23,43.65 58.77,43.65 59.93,42.49 59.93,41.88 60.15,41.66 J3.P$6
TX1_P
  Top 0.3: J2.P$4 33.45,37.15 33.8,36.8 33.8,34.92 36.73,31.99 47.85,31.99 51.55,35.69 51.55,36.3 arc-90 51.92,36.67 52.86,36.67 arc90 53.71,37.52 53.71,37.75 arc90 52.86,38.6 51.95,38.6 arc-90 51.58,38.98 51.58,39.21 arc-90 51.95,39.58 52.86,39.58 arc90 53.71,40.43 53.71,40.66 arc90 52.86,41.51 51.92,41.51 arc-90 51.55,41.88 51.55,42.29 arc-90 52.42,43.17 58.58,43.17 59.45,42.29 59.45,41.88 59.15,41.58 J3.P$4
TX2_N
  Top 0.3: J2.P$3 32.95,37 32.75,36.8 32.75,34.36 36.17,30.95 49.43,30.95 50.42,31.93 arc-90 51.62,31.93 52.59,30.96 arc90 53.12,30.96 53.69,31.53 arc90 53.69,32.06 52.72,33.03 arc-90 52.72,34.23 53.29,34.8 arc-90 54.49,34.8 55.27,34.02 arc90 55.8,34.02 56.36,34.59 arc90 56.36,35.12 55.58,35.9 arc-90 55.58,37.1 56.15,37.66 56.15,41.73 56.81,42.39 58.17,42.39 58.65,41.91 J3.P$3
TX2_P
  Top 0.3: J2.P$1 31.95,37.12 32.27,36.8 32.27,34.16 35.97,30.47 49.63,30.47 50.76,31.59 arc-90 51.28,31.59 52.25,30.63 arc90 53.45,30.63 54.02,31.2 arc90 54.02,32.4 53.05,33.37 arc-90 53.05,33.89 53.62,34.46 arc-90 54.15,34.46 55.12,33.49 arc90 56.32,33.49 56.89,34.06 arc90 56.89,35.27 55.92,36.23 arc-90 55.92,36.76 56.63,37.47 56.63,41.53 56.98,41.88 57.4,41.88 57.66,41.63 57.65,41.62 J3.P$1

### Text on the board
tPlace: Hoky V3 | 20-07-16 | CR20XX
bPlace: Antena
Measures: (Distancia que sobresalen / los bordes de los conectores / desde el borde de la PCB, / es la misma para todos) | USB | HDMI1 | HDMI2 | Gravedad / caja horizontal | Gravedad caja vertical | 1/8'' o M3
Document: SET POLYGON_RATSNEST ON / OFF; / Ancho pista min: 10mil / Via drill: 15mil / Via diam: 31mil